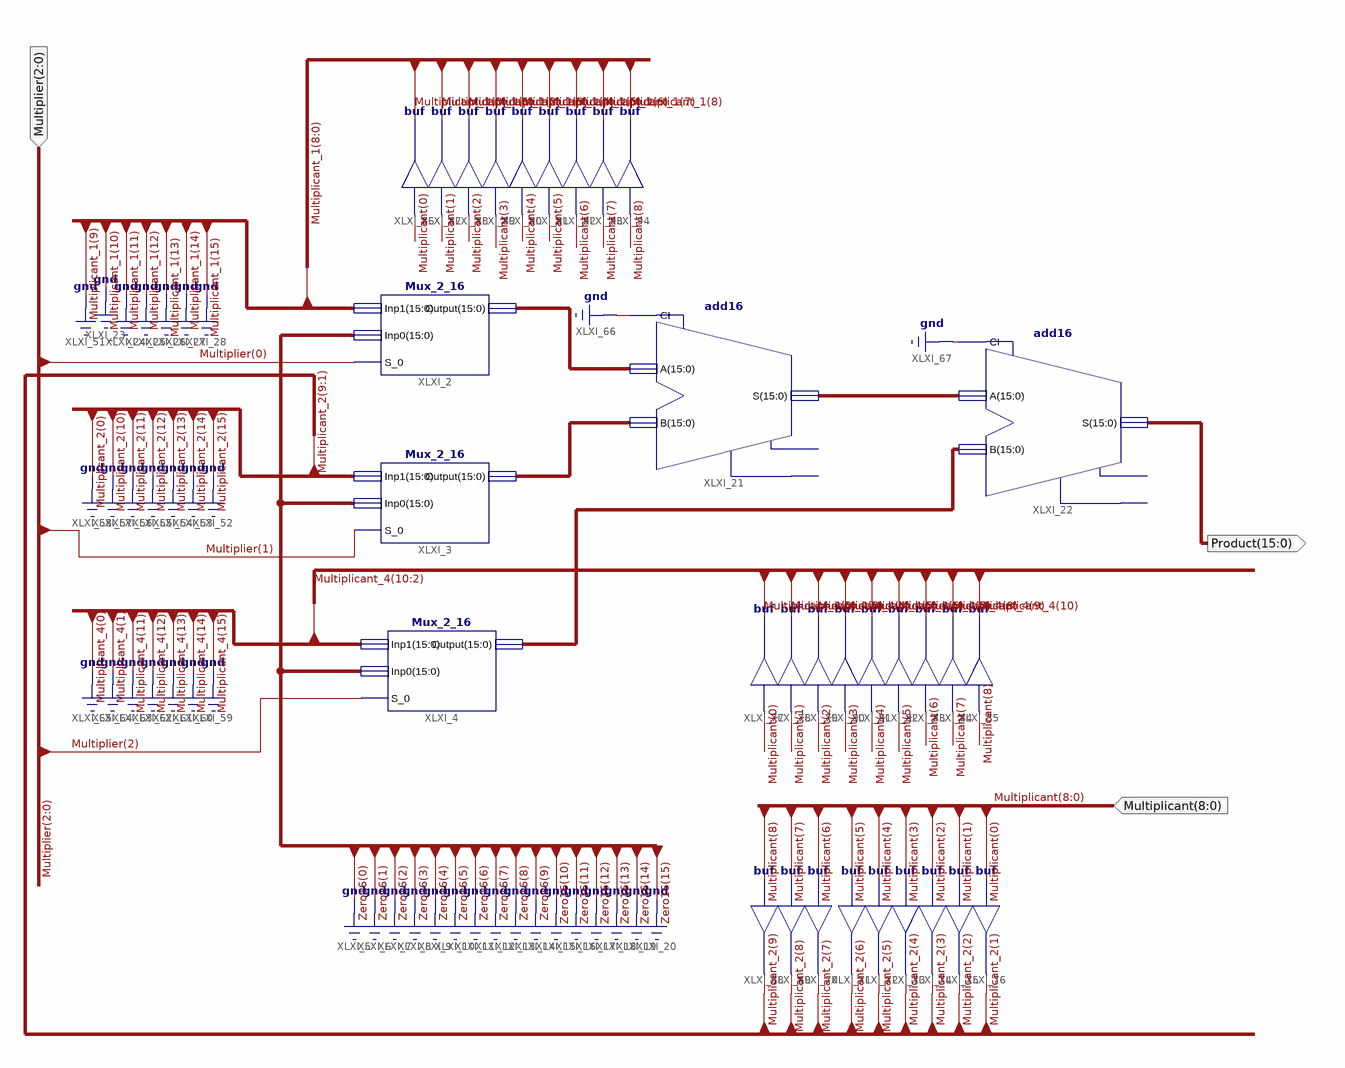
[diagram p0: schematic sheet 1]
// Xilinx ISE schematic Mult_9bit_3Bit_Comb.sch (spartan3e) as structural Verilog: 32 symbols, 3 ports
module Mult_9bit_3Bit_Comb (
  input  [2:0] Multiplier,
  input  [8:0] Multiplicant,
  output [15:0] Product
);

  wire [8:0] Multiplicant_1;
  wire [9:1] Multiplicant_2;
  wire [10:2] Multiplicant_4;
  wire [15:0] XLXN_5, XLXN_6, XLXN_7, XLXN_8;

  Mux_2_16 XLXI_2 (.Inp1({{7{1'b0}}, Multiplicant_1}), .Inp0({16{1'b0}}), .S_0(Multiplier[0]), .Output(XLXN_5));
  Mux_2_16 XLXI_3 (.Inp1({{6{1'b0}}, Multiplicant_2, 1'b0}), .Inp0({16{1'b0}}), .S_0(Multiplier[1]), .Output(XLXN_6));
  Mux_2_16 XLXI_4 (.Inp1({{5{1'b0}}, Multiplicant_4, 2'b00}), .Inp0({16{1'b0}}), .S_0(Multiplier[2]), .Output(XLXN_7));
  add16 XLXI_21 (.A(XLXN_5), .B(XLXN_6), .CI(1'b0), .S(XLXN_8));  // open: CO, OFL
  add16 XLXI_22 (.A(XLXN_8), .B(XLXN_7), .CI(1'b0), .S(Product));  // open: CO, OFL
  buf XLXI_68 (Multiplicant_2[9], Multiplicant[8]);
  buf XLXI_69 (Multiplicant_2[8], Multiplicant[7]);
  buf XLXI_70 (Multiplicant_2[7], Multiplicant[6]);
  buf XLXI_71 (Multiplicant_2[6], Multiplicant[5]);
  buf XLXI_72 (Multiplicant_2[5], Multiplicant[4]);
  buf XLXI_73 (Multiplicant_2[4], Multiplicant[3]);
  buf XLXI_74 (Multiplicant_2[3], Multiplicant[2]);
  buf XLXI_75 (Multiplicant_2[2], Multiplicant[1]);
  buf XLXI_76 (Multiplicant_2[1], Multiplicant[0]);
  buf XLXI_77 (Multiplicant_4[2], Multiplicant[0]);
  buf XLXI_78 (Multiplicant_4[3], Multiplicant[1]);
  buf XLXI_79 (Multiplicant_4[4], Multiplicant[2]);
  buf XLXI_80 (Multiplicant_4[5], Multiplicant[3]);
  buf XLXI_81 (Multiplicant_4[6], Multiplicant[4]);
  buf XLXI_82 (Multiplicant_4[7], Multiplicant[5]);
  buf XLXI_83 (Multiplicant_4[8], Multiplicant[6]);
  buf XLXI_84 (Multiplicant_4[9], Multiplicant[7]);
  buf XLXI_85 (Multiplicant_4[10], Multiplicant[8]);
  buf XLXI_86 (Multiplicant_1[0], Multiplicant[0]);
  buf XLXI_87 (Multiplicant_1[1], Multiplicant[1]);
  buf XLXI_88 (Multiplicant_1[2], Multiplicant[2]);
  buf XLXI_89 (Multiplicant_1[3], Multiplicant[3]);
  buf XLXI_90 (Multiplicant_1[4], Multiplicant[4]);
  buf XLXI_91 (Multiplicant_1[5], Multiplicant[5]);
  buf XLXI_92 (Multiplicant_1[6], Multiplicant[6]);
  buf XLXI_93 (Multiplicant_1[7], Multiplicant[7]);
  buf XLXI_94 (Multiplicant_1[8], Multiplicant[8]);
endmodule
